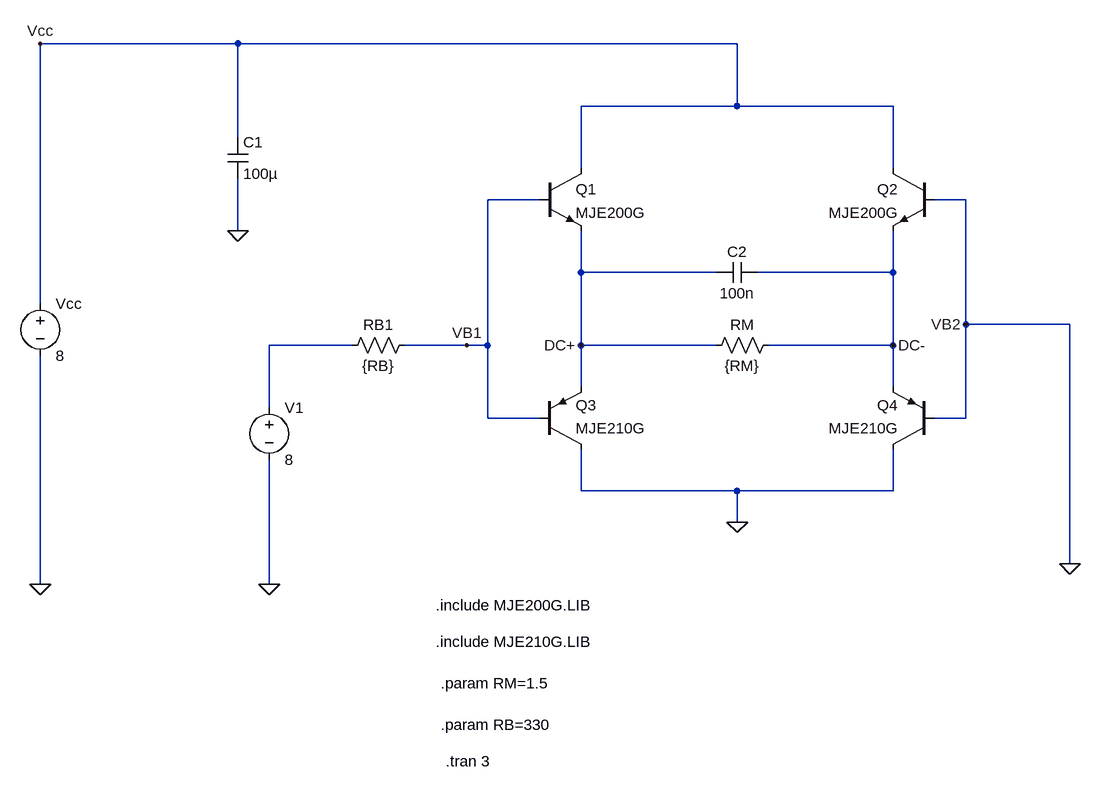
[diagram p0: schematic H-bridge.asc]
H-bridge.asc, the LTspice schematic file:
Version 4
SHEET 1 880 872
WIRE -640 -336 -944 -336
WIRE 128 -336 -640 -336
WIRE 128 -240 128 -336
WIRE 128 -240 -112 -240
WIRE 368 -240 128 -240
WIRE -640 -192 -640 -336
WIRE -112 -144 -112 -240
WIRE 368 -144 368 -240
WIRE -176 -96 -256 -96
WIRE 480 -96 432 -96
WIRE -640 -48 -640 -128
WIRE -112 16 -112 -48
WIRE 96 16 -112 16
WIRE 368 16 368 -48
WIRE 368 16 160 16
WIRE -944 64 -944 -336
WIRE 480 96 480 -96
WIRE 640 96 480 96
WIRE -464 128 -592 128
WIRE -288 128 -384 128
WIRE -256 128 -256 -96
WIRE -256 128 -288 128
WIRE -112 128 -112 16
WIRE 96 128 -112 128
WIRE 368 128 368 16
WIRE 368 128 176 128
WIRE -112 192 -112 128
WIRE 368 192 368 128
WIRE -592 224 -592 128
WIRE -256 240 -256 128
WIRE -176 240 -256 240
WIRE 480 240 480 96
WIRE 480 240 432 240
WIRE -112 352 -112 288
WIRE 128 352 -112 352
WIRE 368 352 368 288
WIRE 368 352 128 352
WIRE 128 400 128 352
WIRE 640 464 640 96
WIRE -944 496 -944 144
WIRE -592 496 -592 304
FLAG -944 496 0
FLAG -640 -48 0
FLAG 640 464 0
FLAG -592 496 0
FLAG -288 128 VB1
FLAG -944 -336 Vcc
FLAG 368 128 DC-
FLAG -112 128 DC+
FLAG 480 96 VB2
FLAG 128 400 0
SYMBOL voltage -944 48 R0
SYMATTR InstName Vcc
SYMATTR Value 8
SYMBOL cap -656 -192 R0
SYMATTR InstName C1
SYMATTR Value 100µ
SYMBOL voltage -592 208 R0
SYMATTR InstName V1
SYMATTR Value 8
SYMBOL res -368 112 R90
WINDOW 0 0 56 VBottom 2
WINDOW 3 32 56 VTop 2
SYMATTR InstName RB1
SYMATTR Value {RB}
SYMBOL npn -176 -144 R0
SYMATTR InstName Q1
SYMATTR Value MJE200G
SYMBOL pnp -176 288 M180
SYMATTR InstName MJE210G
SYMATTR Value Q3
SYMBOL cap 160 0 R90
WINDOW 0 0 32 VBottom 2
WINDOW 3 32 32 VTop 2
SYMATTR InstName C2
SYMATTR Value 100n
SYMBOL res 192 112 R90
WINDOW 0 0 56 VBottom 2
WINDOW 3 32 56 VTop 2
SYMATTR InstName RM
SYMATTR Value {RM}
SYMBOL pnp 432 288 R180
SYMATTR InstName MJE210G
SYMATTR Value Q4
SYMBOL npn 432 -144 M0
SYMATTR InstName Q2
SYMATTR Value MJE200G
TEXT -336 528 Left 2 !.include MJE200G.LIB
TEXT -336 584 Left 2 !.include MJE210G.LIB
TEXT -328 648 Left 2 !.param RM=1.5
TEXT -328 712 Left 2 !.param RB=330
TEXT -320 768 Left 2 !.tran 3

The netlist it stands for:
* H-bridge.asc
Vcc Vcc 0 8
C1 Vcc 0 100µ
V1 N001 0 8
RB1 VB1 N001 {RB}
Q1 Vcc VB1 DC+ 0 MJE200G
Q§MJE210G 0 VB1 DC+ 0 Q3
C2 DC- DC+ 100n
RM DC- DC+ {RM}
Q§MJE210G 0 0 DC- 0 Q4
Q2 Vcc 0 DC- 0 MJE200G
.model NPN NPN
.model PNP PNP
.lib standard.bjt
.include MJE200G.LIB
.include MJE210G.LIB
.param RM=1.5
.param RB=330
.tran 3
.backanno
.end